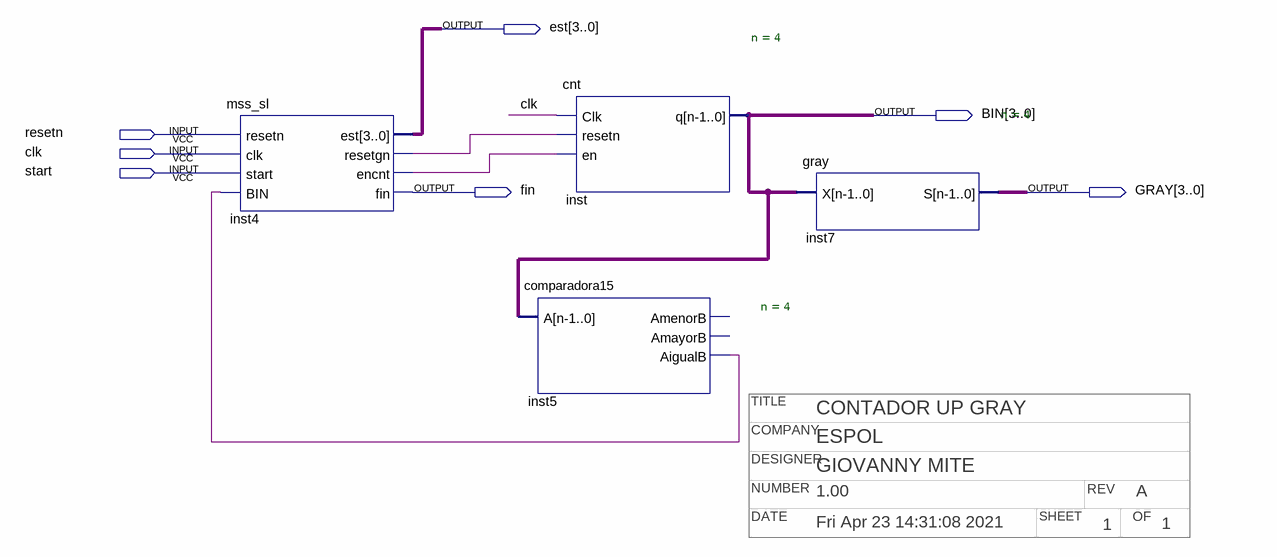
[diagram p0: schematic sheet]
// Quartus schematic ContadorGray.bdf as structural Verilog: 4 symbols, 7 pins
// Title block: COMPANY: ESPOL; DATE: Fri Apr 23 14:31:08 2021; DESIGNER: GIOVANNY MITE; NUMBER: 1.00; OF: 1; REV: A; SHEET: 1; TITLE: CONTADOR UP GRAY
module ContadorGray (
  input  resetn,
  input  clk,
  input  start,
  output [3:0] est,
  output [3:0] BIN,
  output fin,
  output [3:0] GRAY
);

  wire inst4_encnt, inst4_resetgn, inst5_aigualb;

  mss_sl inst4 (
    .resetn(resetn), .clk(clk), .start(start), .BIN(inst5_aigualb), .est(est), .resetgn(inst4_resetgn),
    .encnt(inst4_encnt), .fin(fin));
  cnt #(.n(4)) inst (.Clk(clk), .resetn(inst4_resetgn), .en(inst4_encnt), .q(BIN));
  comparadora15 #(.n(4)) inst5 (.A(BIN), .AigualB(inst5_aigualb));  // open: AmenorB, AmayorB
  gray #(.n(4)) inst7 (.X(BIN), .S(GRAY));
endmodule
